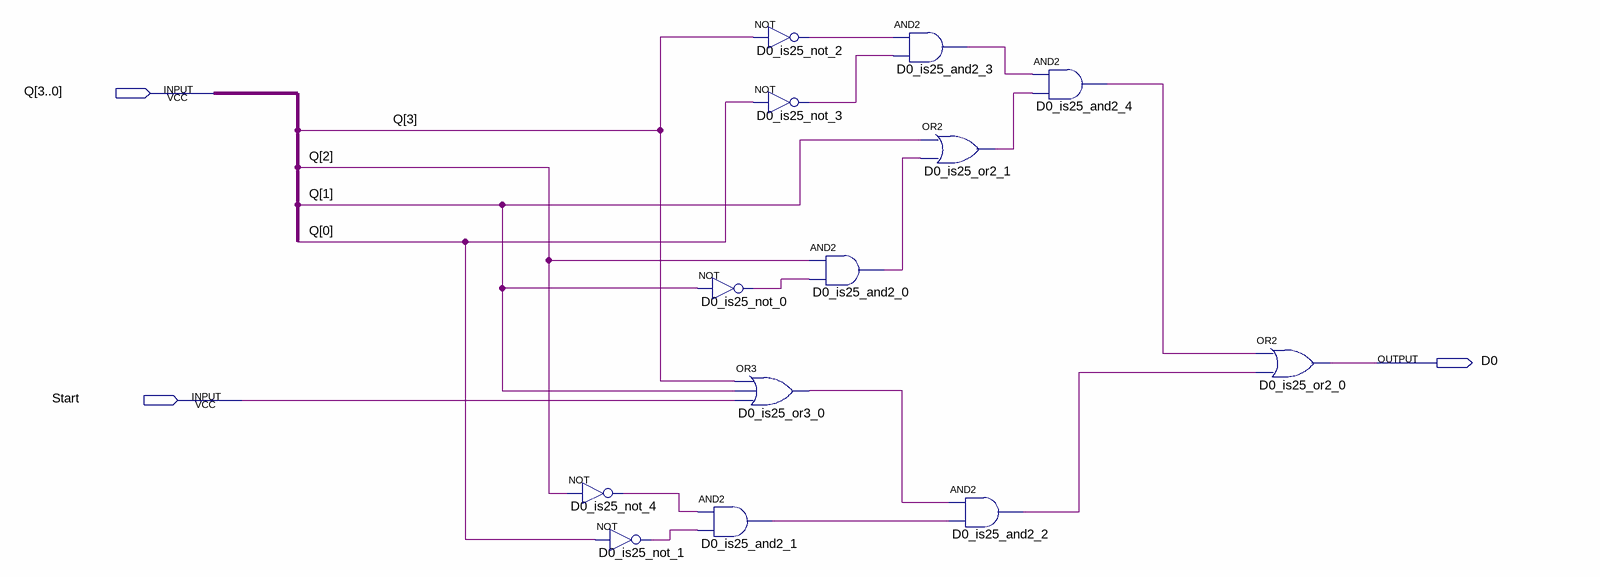
[diagram p0: schematic sheet]
// Quartus schematic D0.bdf as structural Verilog: 13 symbols, 3 pins
module D0 (
  input  [3:0] Q,
  input  Start,
  output D0
);

  wire D0_is25_and2_0_out, D0_is25_and2_1_out, D0_is25_and2_2_out, D0_is25_and2_3_out, D0_is25_and2_4_out,
       D0_is25_not_0_out, D0_is25_not_1_out, D0_is25_not_2_out, D0_is25_not_3_out, D0_is25_not_4_out,
       D0_is25_or2_1_out, D0_is25_or3_0_out;

  not D0_is25_not_4 (D0_is25_not_4_out, Q[2]);
  not D0_is25_not_1 (D0_is25_not_1_out, Q[0]);
  not D0_is25_not_0 (D0_is25_not_0_out, Q[1]);
  and D0_is25_and2_1 (D0_is25_and2_1_out, D0_is25_not_4_out, D0_is25_not_1_out);
  not D0_is25_not_2 (D0_is25_not_2_out, Q[3]);
  not D0_is25_not_3 (D0_is25_not_3_out, Q[0]);
  or D0_is25_or3_0 (D0_is25_or3_0_out, Q[3], Q[1], Start);
  and D0_is25_and2_0 (D0_is25_and2_0_out, Q[2], D0_is25_not_0_out);
  and D0_is25_and2_3 (D0_is25_and2_3_out, D0_is25_not_2_out, D0_is25_not_3_out);
  or D0_is25_or2_1 (D0_is25_or2_1_out, Q[1], D0_is25_and2_0_out);
  and D0_is25_and2_2 (D0_is25_and2_2_out, D0_is25_or3_0_out, D0_is25_and2_1_out);
  and D0_is25_and2_4 (D0_is25_and2_4_out, D0_is25_and2_3_out, D0_is25_or2_1_out);
  or D0_is25_or2_0 (D0, D0_is25_and2_4_out, D0_is25_and2_2_out);
endmodule
